# EAGLE design wordClock (EAGLE 6.3)
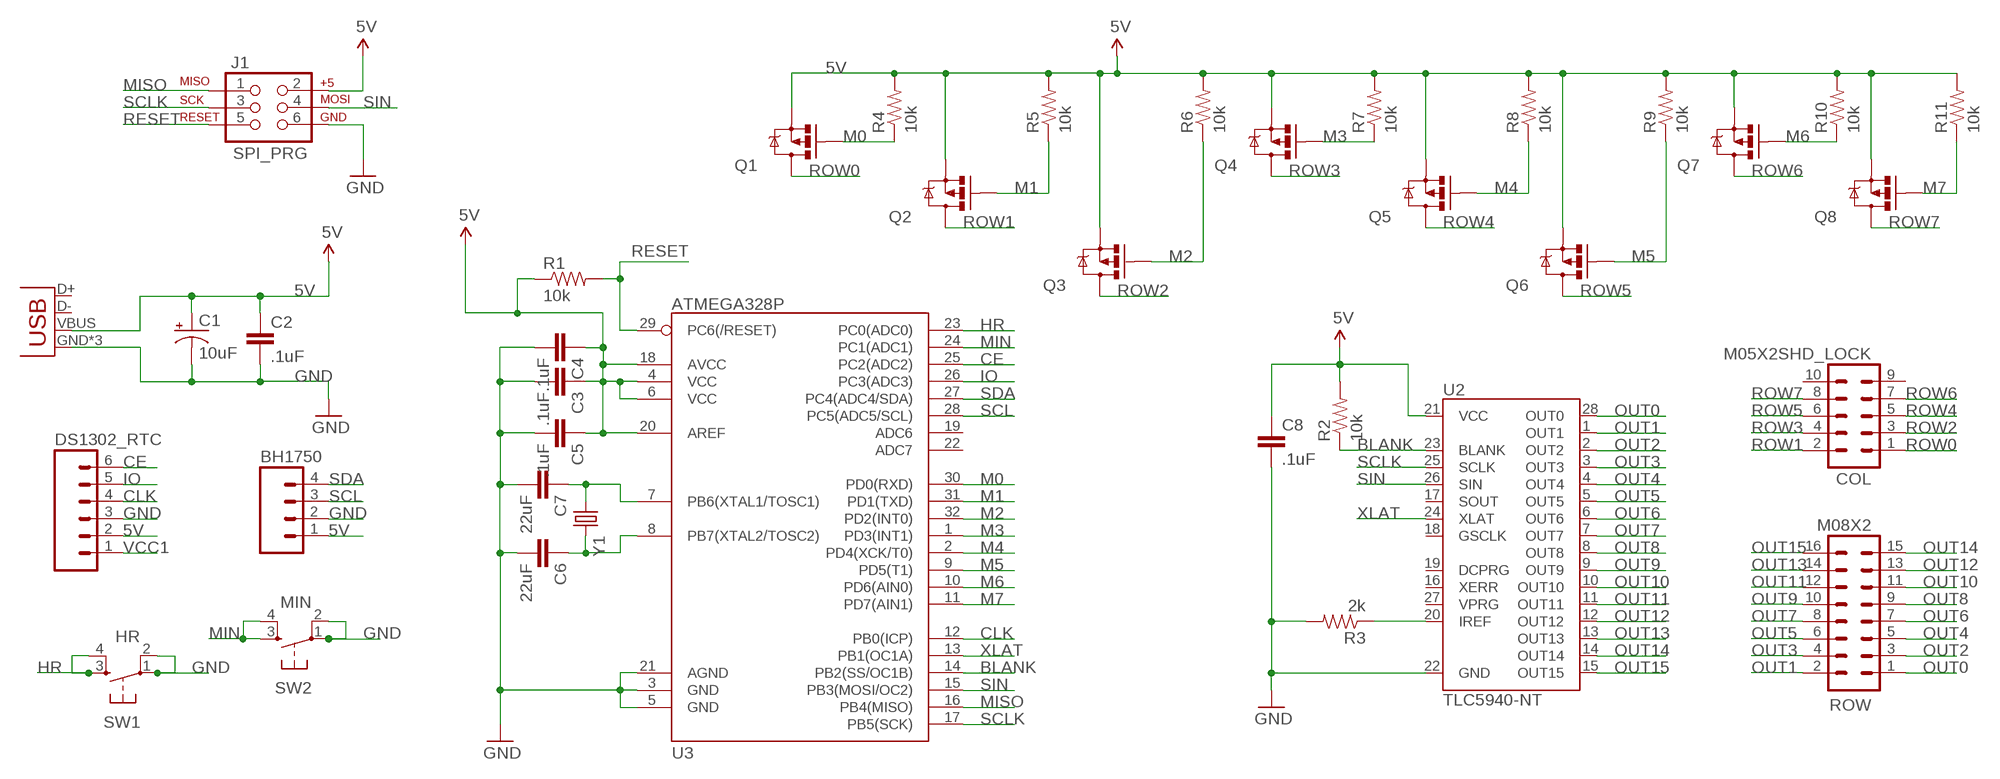
[diagram p0: schematic, sheet 1]

## Parts
BH1750  M04LOCK  [1X04_LOCK]
C1  10uF  CAP_POLD  [PANASONIC_D]
C2  .1uF  CAP0805  [0805]
C3  .1uF  CAP0805  [0805]
C4  .1uF  CAP0805  [0805]
C5  .1uF  CAP0805  [0805]
C6  22uF  CAP0805  [0805]
C7  22uF  CAP0805  [0805]
C8  .1uF  CAP0805  [0805]
COL  M05X2SHD_LOCK  [2X5-SHROUDED_LOCK]
DS1302_RTC  M06FEMALE_LOCK  [1X06_FEMALE_LOCK.010]
J1  SPI_PRG  AVR_SPI_PRG_62X3_LOCK  [2X3_LOCK]
JP1  USB-MICROB  [USB-MICROB]
Q1  MOSFET-PCHANNELSMD  [SOT23-3]
Q2  MOSFET-PCHANNELSMD  [SOT23-3]
Q3  MOSFET-PCHANNELSMD  [SOT23-3]
Q4  MOSFET-PCHANNELSMD  [SOT23-3]
Q5  MOSFET-PCHANNELSMD  [SOT23-3]
Q6  MOSFET-PCHANNELSMD  [SOT23-3]
Q7  MOSFET-PCHANNELSMD  [SOT23-3]
Q8  MOSFET-PCHANNELSMD  [SOT23-3]
R1  10k  RESISTOR0805-RES  [0805]
R2  10k  RESISTOR0805-RES  [0805]
R3  2k  RESISTOR0805-RES  [0805]
R4  10k  RESISTOR0805-RES  [0805]
R5  10k  RESISTOR0805-RES  [0805]
R6  10k  RESISTOR0805-RES  [0805]
R7  10k  RESISTOR0805-RES  [0805]
R8  10k  RESISTOR0805-RES  [0805]
R9  10k  RESISTOR0805-RES  [0805]
R10  10k  RESISTOR0805-RES  [0805]
R11  10k  RESISTOR0805-RES  [0805]
ROW  M08X2  [2X8]
SW1  HR  TAC_SWITCHPTH  [TACTILE-PTH]
SW2  MIN  TAC_SWITCHPTH  [TACTILE-PTH]
U2  TLC5940-NT  [DIL28-3]
U3  ATMEGA328P  ATMEGA328_SMT  [TQFP32-08]
Y1  CRYSTALHC49UV  [HC49U-V]

## Nets
5V: BH1750.1 C1.+ C2.1 C3.1 C4.1 C5.1 C8.1 DS1302_RTC.2 J1.2 JP1.VBUS Q1.2(S) Q2.2(S) Q3.2(S) Q4.2(S) Q5.2(S) Q6.2(S) Q7.2(S) Q8.2(S) R1.1 R2.2 R4.2 R5.2 R6.2 R7.2 R8.2 R9.2 R10.2 R11.2 U2.21(VCC) U3.4(VCC) U3.6(VCC) U3.18(AVCC) U3.20(AREF)
BLANK: R2.1 U2.23(BLANK) U3.14(PB2(SS/OC1B))
CE: DS1302_RTC.6 U3.25(PC2(ADC2))
CLK: DS1302_RTC.4 U3.12(PB0(ICP))
GND: BH1750.2 C1.- C2.2 C3.2 C4.2 C5.2 C6.2 C7.2 C8.2 DS1302_RTC.3 J1.6 JP1.GND JP1.MT1(GND) JP1.MT2(GND) R3.2 SW1.1 SW1.2 SW2.1 SW2.2 U2.22(GND) U3.3(GND) U3.5(GND) U3.21(AGND)
HR: SW1.3 SW1.4 U3.23(PC0(ADC0))
IO: DS1302_RTC.5 U3.26(PC3(ADC3))
M0: Q1.1(G) R4.1 U3.30(PD0(RXD))
M1: Q2.1(G) R5.1 U3.31(PD1(TXD))
M2: Q3.1(G) R6.1 U3.32(PD2(INT0))
M3: Q4.1(G) R7.1 U3.1(PD3(INT1))
M4: Q5.1(G) R8.1 U3.2(PD4(XCK/T0))
M5: Q6.1(G) R9.1 U3.9(PD5(T1))
M6: Q7.1(G) R10.1 U3.10(PD6(AIN0))
M7: Q8.1(G) R11.1 U3.11(PD7(AIN1))
MIN: SW2.3 SW2.4 U3.24(PC1(ADC1))
MISO: J1.1 U3.16(PB4(MISO))
N$1: R3.1 U2.20(IREF)
N$2: C6.1 U3.8(PB7(XTAL2/TOSC2)) Y1.2
N$4: C7.1 U3.7(PB6(XTAL1/TOSC1)) Y1.1
OUT0: ROW.1 U2.28(OUT0)
OUT1: ROW.2 U2.1(OUT1)
OUT2: ROW.3 U2.2(OUT2)
OUT3: ROW.4 U2.3(OUT3)
OUT4: ROW.5 U2.4(OUT4)
OUT5: ROW.6 U2.5(OUT5)
OUT6: ROW.7 U2.6(OUT6)
OUT7: ROW.8 U2.7(OUT7)
OUT8: ROW.9 U2.8(OUT8)
OUT9: ROW.10 U2.9(OUT9)
OUT10: ROW.11 U2.10(OUT10)
OUT11: ROW.12 U2.11(OUT11)
OUT12: ROW.13 U2.12(OUT12)
OUT13: ROW.14 U2.13(OUT13)
OUT14: ROW.15 U2.14(OUT14)
OUT15: ROW.16 U2.15(OUT15)
RESET: J1.5 R1.2 U3.29(PC6(/RESET))
ROW0: COL.1 Q1.3(D)
ROW1: COL.2 Q2.3(D)
ROW2: COL.3 Q3.3(D)
ROW3: COL.4 Q4.3(D)
ROW4: COL.5 Q5.3(D)
ROW5: COL.6 Q6.3(D)
ROW6: COL.7 Q7.3(D)
ROW7: COL.8 Q8.3(D)
SCL: BH1750.3 U3.28(PC5(ADC5/SCL))
SCLK: J1.3 U2.25(SCLK) U3.17(PB5(SCK))
SDA: BH1750.4 U3.27(PC4(ADC4/SDA))
SIN: J1.4 U2.26(SIN) U3.15(PB3(MOSI/OC2))
VCC1: DS1302_RTC.1
XLAT: U2.24(XLAT) U3.13(PB1(OC1A))
Unconnected: COL.9 COL.10 JP1.D+ JP1.D- U2.16(XERR) U2.17(SOUT) U2.18(GSCLK) U2.19(DCPRG) U2.27(VPRG) U3.19(ADC6) U3.22(ADC7)

## Library data of the parts
BH1750 = SparkFun-Connectors:M04: Header 4 Standard 4-pin 0.1" header. Use with straight break away headers (SKU : PRT-00116), right angle break away headers (PRT-00553), swiss pins (PRT-00743), machine pins (PRT-00117), and female headers (PRT-00115). Molex polarized connector foot print use with SKU : PRT-08231 with associated crimp pins and housings. 1MM SMD Version SKU: PRT-10208
C1 = SparkFun-Passives:CAP_POL: Capacitor Polarized These are standard SMD and PTH capacitors. Normally 10uF, 47uF, and 100uF in electrolytic and tantalum varieties. Always verify the external diameter of the through hole cap, it varies with capacity, voltage, and manufacturer. The EIA devices should be standard.
C2-C8 = SparkFun-Passives:CAP: Capacitor Standard 0603 ceramic capacitor, and 0.1" leaded capacitor.
COL = SparkFun-Connectors:M05X2: Header 5x2 Standard 10-pin dual row 0.1" header. Commonly used with AVR-ISP. Use with Spark Fun Electronics SKU: PRT-00778
DS1302_RTC = SparkFun-Connectors:M06: Header 6 Standard 6-pin 0.1" header. Use with straight break away headers (SKU : PRT-00116), right angle break away headers (PRT-00553), swiss pins (PRT-00743), machine pins (PRT-00117), and female headers (PRT-00115). Molex polarized connector foot print use with SKU : PRT-08094 with associated crimp pins and housings. NOTES ON THE VARIANTS LOCK and LOCK_LONGPADS... This footprint was designed to help hold the alignment of a through-hole component (i.e. 6-pin header) while soldering it into place. You may notice that each hole has been shifted either up or down by 0.005 of an inch from it's more standard position (which is a perfectly straight line). This slight alteration caused the pins (the squares in the middle) to touch the edges of the holes. Because they are alternating, it causes a "brace" to hold the component in place. 0.005 has proven to be the perfect amount of "off-center" position when using our standard breakaway headers. Although looks a little odd when you look at the bare footprint, once you have a header in there, the alteration is very hard to notice. Also, if you push a header all the way into place, it is covered up entirely on the bottom side. This idea of altering the position of holes to aid alignment will be further integrated into the Sparkfun Library for other footprints. It can help hold any component with 3 or more connection pins.
J1 = SparkFun-Connectors:AVR_SPI_PRG_6: AVR ISP 6 Pin This is the reduced ISP connector for AVR programming. Common on Arduino. This footprint will take up less PCB space and can be used with a 10-pin to 6-pin adapter such as SKU: BOB-08508
JP1 = SparkFun-Connectors:USB: USB Connectors USB-B-PTH is fully proven SKU : PRT-00139/CONN-08278 USB-miniB is fully proven SKU : PRT-00587 USB-A-PCB is untested. USB-A-H is throughly reviewed, but untested. Spark Fun Electronics SKU : PRT-00437 USB-B-SMT is throughly reviewed, but untested. Needs silkscreen touching up. USB-A-S has not been used/tested USB-MB-H has not been used/tested USB-MICROB has been used. CONN-09505; PROD_ID: CONN-09505
Q1-Q8 = SparkFun-DiscreteSemi:MOSFET-PCHANNEL: Generic PMOSFET
R1-R11 = SparkFun-Passives:RESISTOR: Resistor Basic schematic elements and footprints for 0603, 1206, and PTH resistors.
ROW = SparkFun-Connectors:M08X2: .1" headers, two rows of 8 each
SW1 SW2 = SparkFun-Electromechanical:TAC_SWITCH: Momentary Switch Button commonly used for reset or general input. Spark Fun Electronics SKU : COM-00097 SMT- SWCH-08247
U2 = SparkFun-DigitalIC:TLC5940: 16-channel LED Driver with Dot Correction and Grayscale PWM Control The TLC5940 is a 16-channel, constant-current sink LED driver. Each channel has an individually adjustable 4096-step grayscale PWM brightness control and a 64-step, constant-current sink (dot correction). The dot correction adjusts the brightness variations between LED channels and other LED drivers. The dot correction data is stored in an integrated EEPROM. Both grayscale control and dot correction are accessible via a serial interface. A single external resistor sets the maximum current value of all 16 channels. Packages: 28-pin HTSSOP 32-pin 5x5mm QFN 28-pin DIP
U3 = SparkFun-DigitalIC:ATMEGA328_SMT: 32-Pin Atmega328 part Commonly used on Arduino compatible boards Available in QFP and QFN packages TQFP is IC-09069 QFN is non-stock; PROD_ID: IC-09069
Y1 = SparkFun-FreqCtrl:CRYSTAL: Various standard crystals. Proven footprints. Spark Fun Electronics SKU : COM-00534

## Board
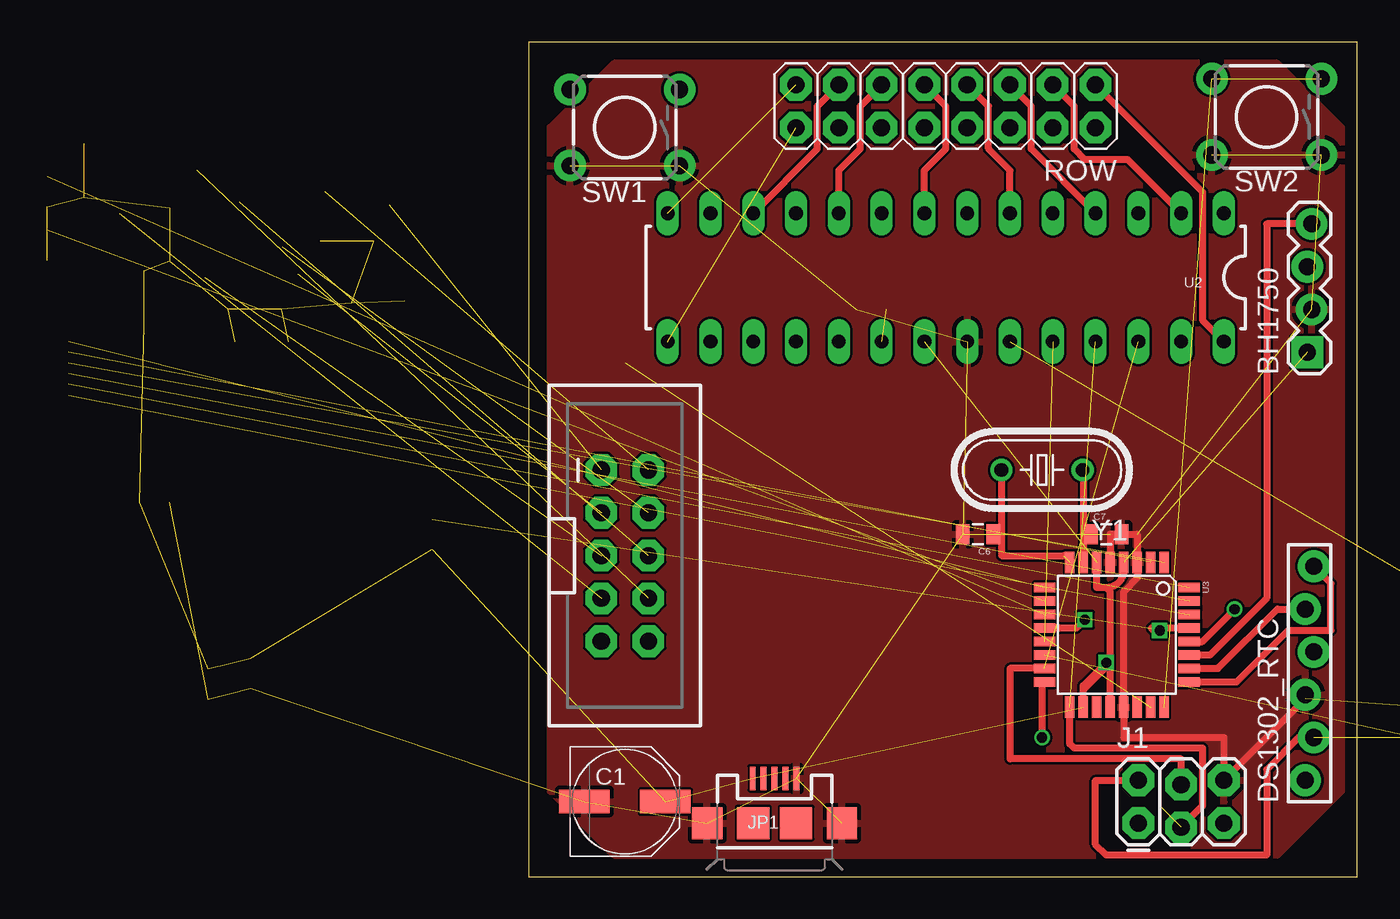
[diagram p1: board, top side]
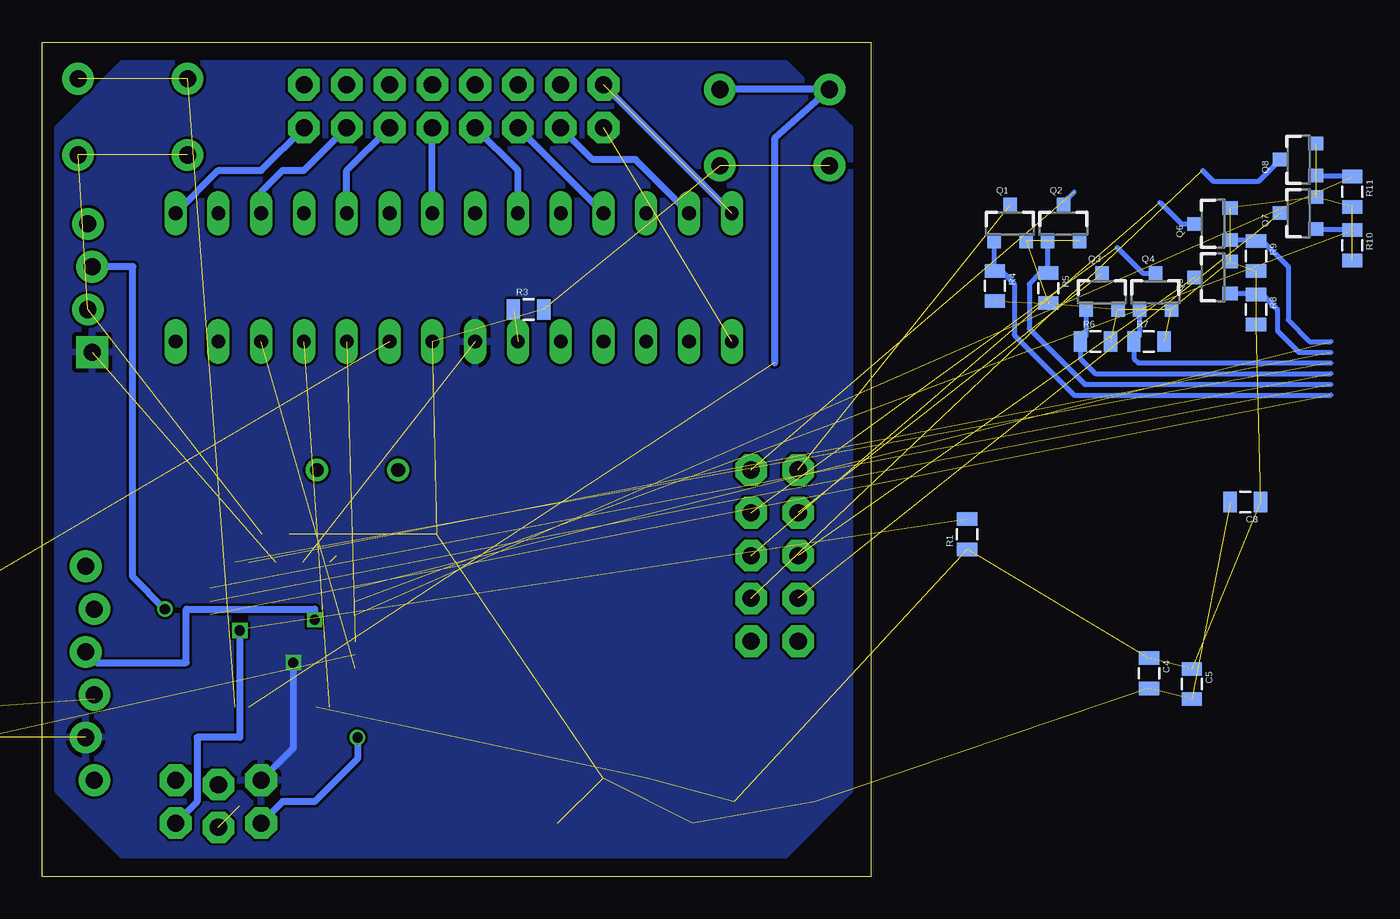
[diagram p2: board, bottom side, seen from below]

Size 49.2 x 49.52 mm. Coordinates in mm from the lower left corner, seen from the top.
Outline: 0,0 49.2,0 49.2,49.52 0,49.52 0,0
Copper layers (1*16): Top 0.035mm / dielectric 1.5mm / Bottom 0.035mm
Design rules "default": minimum track width 6mil, minimum drill 12mil, track to track 6mil, track to pad 6mil, pad to pad 6mil, via to via 6mil, smd to smd 0mil, copper to edge 10mil, drill to drill 10mil, minimum pad ring 10mil, minimum via ring 6mil, stop-mask expansion 2mil, vias tented up to drill 100mil, thermal gap 10mil

### Footprints (pad centres in the part's own frame; a part is rotated, then mirrored left to right if it is on the bottom)
1X04_LOCK = drill 1.016 pad 1.88 square: 1 0,0.127 | drill 1.016 pad 1.88: 2 2.54,-0.127; 3 5.08,0.127; 4 7.62,-0.127
PANASONIC_D = smd 3 x 1.4: + 2.4,0; - -2.4,0
0805 = smd 0.8 x 1.2: 1 -0.9,0; 2 0.9,0
2X5-SHROUDED_LOCK = drill 1.016 pad 1.88 octagon: 1 -1.397,5.08; 2 1.397,5.08; 3 -1.397,2.54; 4 1.397,2.54; 5 -1.397,0; 6 1.397,0; 7 -1.397,-2.54; 8 1.397,-2.54; 9 -1.397,-5.08; 10 1.397,-5.08
1X06_FEMALE_LOCK.010 = drill 1.016 pad 1.88: 1 0,0.254; 2 2.54,-0.254; 3 5.08,0.254; 4 7.62,-0.254; 5 10.16,0.254; 6 12.7,-0.254
2X3_LOCK = drill 1.016 pad 1.88 octagon: 1 0,0; 2 0,2.54; 3 2.54,-0.254; 4 2.54,2.286; 5 5.08,0; 6 5.08,2.54
USB-MICROB = smd 0.35 x 1.4: D+ 0,2.65; D- -0.65,2.65; GND 1.3,2.65; ID 0.65,2.65; VBUS -1.3,2.65 | smd 1.8 x 1.9: MT1 -4,0; MT2 4,0 | smd 1.9 x 1.9: P$1 -1.27,0; P$2 1.27,0
SOT23-3 = smd 0.8 x 0.9: 1 -0.95,-1; 2 0.95,-1; 3 0,1.1
2X8 = drill 1.016 pad 1.88 octagon: 1 0,0; 2 0,2.54; 3 2.54,0; 4 2.54,2.54; 5 5.08,0; 6 5.08,2.54; 7 7.62,0; 8 7.62,2.54; 9 10.16,0; 10 10.16,2.54; 11 12.7,0; 12 12.7,2.54; 13 15.24,0; 14 15.24,2.54; 15 17.78,0; 16 17.78,2.54
TACTILE-PTH = drill 1.016 pad 1.88: 1 -3.251,2.261; 2 3.251,2.261; 3 -3.251,-2.261; 4 3.251,-2.261
DIL28-3 = drill 0.813 long: 1 -16.51,-3.81; 2 -13.97,-3.81; 3 -11.43,-3.81; 4 -8.89,-3.81; 5 -6.35,-3.81; 6 -3.81,-3.81; 7 -1.27,-3.81; 8 1.27,-3.81; 9 3.81,-3.81; 10 6.35,-3.81; 11 8.89,-3.81; 12 11.43,-3.81; 13 13.97,-3.81; 14 16.51,-3.81; 15 16.51,3.81; 16 13.97,3.81; 17 11.43,3.81; 18 8.89,3.81; 19 6.35,3.81; 20 3.81,3.81; 21 1.27,3.81; 22 -1.27,3.81; 23 -3.81,3.81; 24 -6.35,3.81; 25 -8.89,3.81; 26 -11.43,3.81; 27 -13.97,3.81; 28 -16.51,3.81
TQFP32-08 = smd 1.27 x 0.559: 1 -4.293,2.8; 2 -4.293,2; 3 -4.293,1.2; 4 -4.293,0.4; 5 -4.293,-0.4; 6 -4.293,-1.2; 7 -4.293,-2; 8 -4.293,-2.8; 17 4.293,-2.8; 18 4.293,-2; 19 4.293,-1.2; 20 4.293,-0.4; 21 4.293,0.4; 22 4.293,1.2; 23 4.293,2; 24 4.293,2.8 | smd 0.559 x 1.27: 9 -2.8,-4.293; 10 -2,-4.293; 11 -1.2,-4.293; 12 -0.4,-4.293; 13 0.4,-4.293; 14 1.2,-4.293; 15 2,-4.293; 16 2.8,-4.293; 25 2.8,4.293; 26 2,4.293; 27 1.2,4.293; 28 0.4,4.293; 29 -0.4,4.293; 30 -1.2,4.293; 31 -2,4.293; 32 -2.8,4.293
HC49U-V = drill 0.813: 1 -2.413,0; 2 2.413,0

### Placement (x,y rotation side)
BH1750  46.35,31.11 90 top
C1  5.71,4.45 0 top
C2  77.47,5.71 180 bottom  (outside the outline)
C3  77.47,8.26 180 bottom  (outside the outline)
C4  -16.51,12.06 270 bottom  (outside the outline)
C5  -19.05,11.43 270 bottom  (outside the outline)
C6  26.67,20.32 180 top
C7  34.29,20.32 0 top
C8  -22.23,22.23 180 bottom  (outside the outline)
COL  5.71,19.05 0 top
DS1302_RTC  46.35,5.71 90 top
J1  36.2,3.17 0 top
JP1  14.61,3.17 0 top
Q1  -8.26,38.73 0 bottom  (outside the outline)
Q2  -11.43,38.73 0 bottom  (outside the outline)
Q3  -13.72,34.67 0 bottom  (outside the outline)
Q4  -16.89,34.67 0 bottom  (outside the outline)
Q5  -20.32,35.56 90 bottom  (outside the outline)
Q6  -20.32,38.73 90 bottom  (outside the outline)
Q7  -25.4,39.37 90 bottom  (outside the outline)
Q8  -25.4,42.55 90 bottom  (outside the outline)
R1  -5.71,20.32 90 bottom  (outside the outline)
R2  77.47,2.54 0 bottom  (outside the outline)
R3  20.32,33.66 0 bottom
R4  -7.37,35.05 270 bottom  (outside the outline)
R5  -10.54,34.92 270 bottom  (outside the outline)
R6  -13.34,31.75 0 bottom  (outside the outline)
R7  -16.51,31.75 0 bottom  (outside the outline)
R8  -22.86,33.66 270 bottom  (outside the outline)
R9  -22.86,36.83 270 bottom  (outside the outline)
R10  -28.57,37.47 270 bottom  (outside the outline)
R11  -28.57,40.64 270 bottom  (outside the outline)
ROW  33.66,46.99 180 top
SW1  5.71,44.45 180 top
SW2  43.81,45.09 180 top
U2  24.77,35.56 180 top
U3  34.92,14.35 270 top
Y1  30.48,24.13 180 top

### Tracks (layer width: path | path; a pad name or v marks a point on that pad's centre or on a via)
5V  (via drill 0.6)  (27 unrouted)
  Top 0.406: U3.4 35.33,18.18 arc-90 34.29,17.14 | 34.29,17.14 33.73,17.14 U3.6 | U3.20 34.52,12.7 | 34.52,12.7 34.52,16.91 34.29,17.14 | 34.52,12.7 32.92,11.1 U3.18 32.92,11.34 v34.29,12.7 | DS1302_RTC.2 45.72,8.26 43.81,6.35 43.81,1.27 34.29,1.27 33.66,1.91 33.66,5.71 J1.2
  Bottom 0.406: v34.29,12.7 34.29,7.62 J1.2
  pour Bottom: 1.27,44.45 1.27,5.08 5.08,1.27 44.45,1.27 48.26,5.08 48.26,44.45 44.45,48.26 5.08,48.26
BLANK  (2 unrouted)
CE
  Top 0.406: U3.25 42.03,11.55 45.09,14.61 47.62,14.61 47.62,17.4 DS1302_RTC.6
CLK  (via drill 0.6)
  Top 0.406: v33.02,15.24 32.53,14.75 U3.12
  Bottom 0.406: DS1302_RTC.4 45.97,12.7 40.64,12.7 40.64,15.88 33.02,15.88 v33.02,15.24
GND  (17 unrouted)
  Top 0.406: U3.5 34.52,20.32 C7.2 36.12,20.32 U3.3 36.2,18.57 36.2,17.78 35.33,16.91 U3.21 35.33,8.26 41.27,8.26 J1.6 46.1,10.54 DS1302_RTC.3
  pour Top: 16.51,1.27 44.45,1.27 48.26,5.08 48.26,44.45 44.45,48.26 5.08,48.26 1.27,44.45 1.27,5.08 5.08,1.27
HR  (1 unrouted)
  Bottom 0.406: SW1.3 SW1.4 5.71,43.81 5.71,30.48
IO
  Top 0.406: U3.26 40.93,12.35 44.45,15.88 DS1302_RTC.5
M0  (1 unrouted)
  Bottom 0.305: Q1.1 -7.3,36.01 R4.1 -7.74,35.95 -8.51,35.18 -8.51,32.13 -12.06,28.57 -27.3,28.57
M1  (1 unrouted)
  Bottom 0.305: Q2.1 -10.48,35.89 R5.1 -10.04,35.83 -9.4,35.18 -9.4,32.51 -12.7,29.21 -27.3,29.21
M2  (1 unrouted)
  Bottom 0.305: Q3.1 -12.77,32.08 R6.1 -12.44,30.75 -13.34,29.84 -27.3,29.84
M3  (1 unrouted)
  Bottom 0.305: Q4.1 -15.94,32.08 R7.1 -15.61,30.75 -15.88,30.48 -27.3,30.48
M4  (1 unrouted)
  Bottom 0.305: Q5.1 -22.8,34.61 R8.1 -23.23,34.55 -24.13,33.66 -24.13,32.38 -25.4,31.11 -27.3,31.11
M5  (1 unrouted)
  Bottom 0.305: Q6.1 -22.8,37.78 R9.1 -23.23,37.73 -24.77,36.2 -24.77,33.02 -26.04,31.75 -27.3,31.75
M6  (1 unrouted)
  Bottom 0.305: Q7.1 -28.52,38.42 R10.1
M7  (1 unrouted)
  Bottom 0.305: Q8.1 -28.52,41.59 R11.1
MIN  (2 unrouted)
MISO  (via drill 0.6)
  Top 0.406: U3.16 30.48,11.55 v30.48,8.26
  Bottom 0.406: v30.48,8.26 30.48,6.99 33.02,4.45 34.92,4.45 J1.1
N$1  (1 unrouted)
N$2  (1 unrouted)
  Top 0.406: Y1.2 28.07,20.32 | 28.07,20.32 28.07,19.05 31.75,19.05 | C6.1 28.07,20.32
N$4
  Top 0.406: Y1.1 32.92,23.72 32.92,20.32 | 32.92,20.32 U3.7 | C7.1 32.92,20.32
OUT0
  Top 0.406: ROW.1 40.01,40.64 40.01,33.02 U2.28
OUT1
  Bottom 0.406: U2.1 38.73,41.91 36.2,41.91 ROW.2
OUT2
  Top 0.406: U2.2 35.56,42.55 33.02,42.55 32.38,43.18 32.38,45.72 ROW.3
OUT3
  Bottom 0.406: U2.3 36.2,40.64 34.92,41.91 33.66,41.91 ROW.4
OUT4
  Top 0.406: U2.4 29.84,43.18 29.84,45.72 ROW.5
OUT5
  Bottom 0.406: U2.5 31.11,41.91 ROW.6
OUT6
  Top 0.406: U2.6 28.57,41.91 27.3,43.18 27.3,45.72 ROW.7
OUT7
  Bottom 0.406: U2.7 ROW.8
OUT8
  Top 0.406: U2.8 23.5,41.91 24.77,43.18 24.77,45.72 ROW.9
OUT9
  Bottom 0.406: U2.9 20.95,41.91 ROW.10
OUT10
  Top 0.406: U2.10 18.41,41.91 19.68,43.18 19.68,45.72 ROW.11
OUT11
  Bottom 0.406: U2.11 ROW.12
OUT12
  Top 0.406: U2.12 17.14,43.18 17.14,45.72 ROW.13
OUT13
  Bottom 0.406: U2.13 13.97,42.55 16.51,42.55 ROW.14
OUT14  (1 unrouted)
  Bottom 0.406: U2.14 ROW.15
OUT15  (1 unrouted)
RESET  (via drill 0.6)  (1 unrouted)
  Top 0.406: U3.29 36.98,14.75 arc90 v37.47,14.61
  Bottom 0.406: v37.47,14.61 37.47,8.26 40.01,8.26 40.01,4.45 J1.5
ROW0  (1 unrouted)
ROW1  (1 unrouted)
  Bottom 0.305: Q2.3 -11.43,40.01 -12.06,40.64
ROW2  (1 unrouted)
ROW3  (1 unrouted)
  Bottom 0.305: -14.61,37.34 -16.13,35.81 -16.85,35.81 Q4.3
ROW4  (1 unrouted)
ROW5  (1 unrouted)
  Bottom 0.305: -17.14,40.01 -18.41,38.73 Q6.3
ROW6  (1 unrouted)
ROW7  (1 unrouted)
  Bottom 0.305: -19.68,41.91 -20.32,41.27 -23.03,41.27 Q8.3
SCL  (via drill 0.6)
  Top 0.406: U3.28 39.99,13.95 v41.91,15.88
  Bottom 0.406: v41.91,15.88 43.81,17.78 43.81,36.2 BH1750.3
SCLK  (2 unrouted)
  Top 0.406: U3.17 32.12,7.88 32.38,7.62 40.01,7.62 40.01,4.19 J1.3
SDA
  Top 0.406: BH1750.4 43.81,38.73 43.81,16.51 40.46,13.15 U3.27
SIN  (1 unrouted)
  Top 0.406: J1.4 38.73,6.99 28.57,6.99 28.57,12.35 U3.15
XLAT  (1 unrouted)